# Altium project parry_pcb.PrjPCB
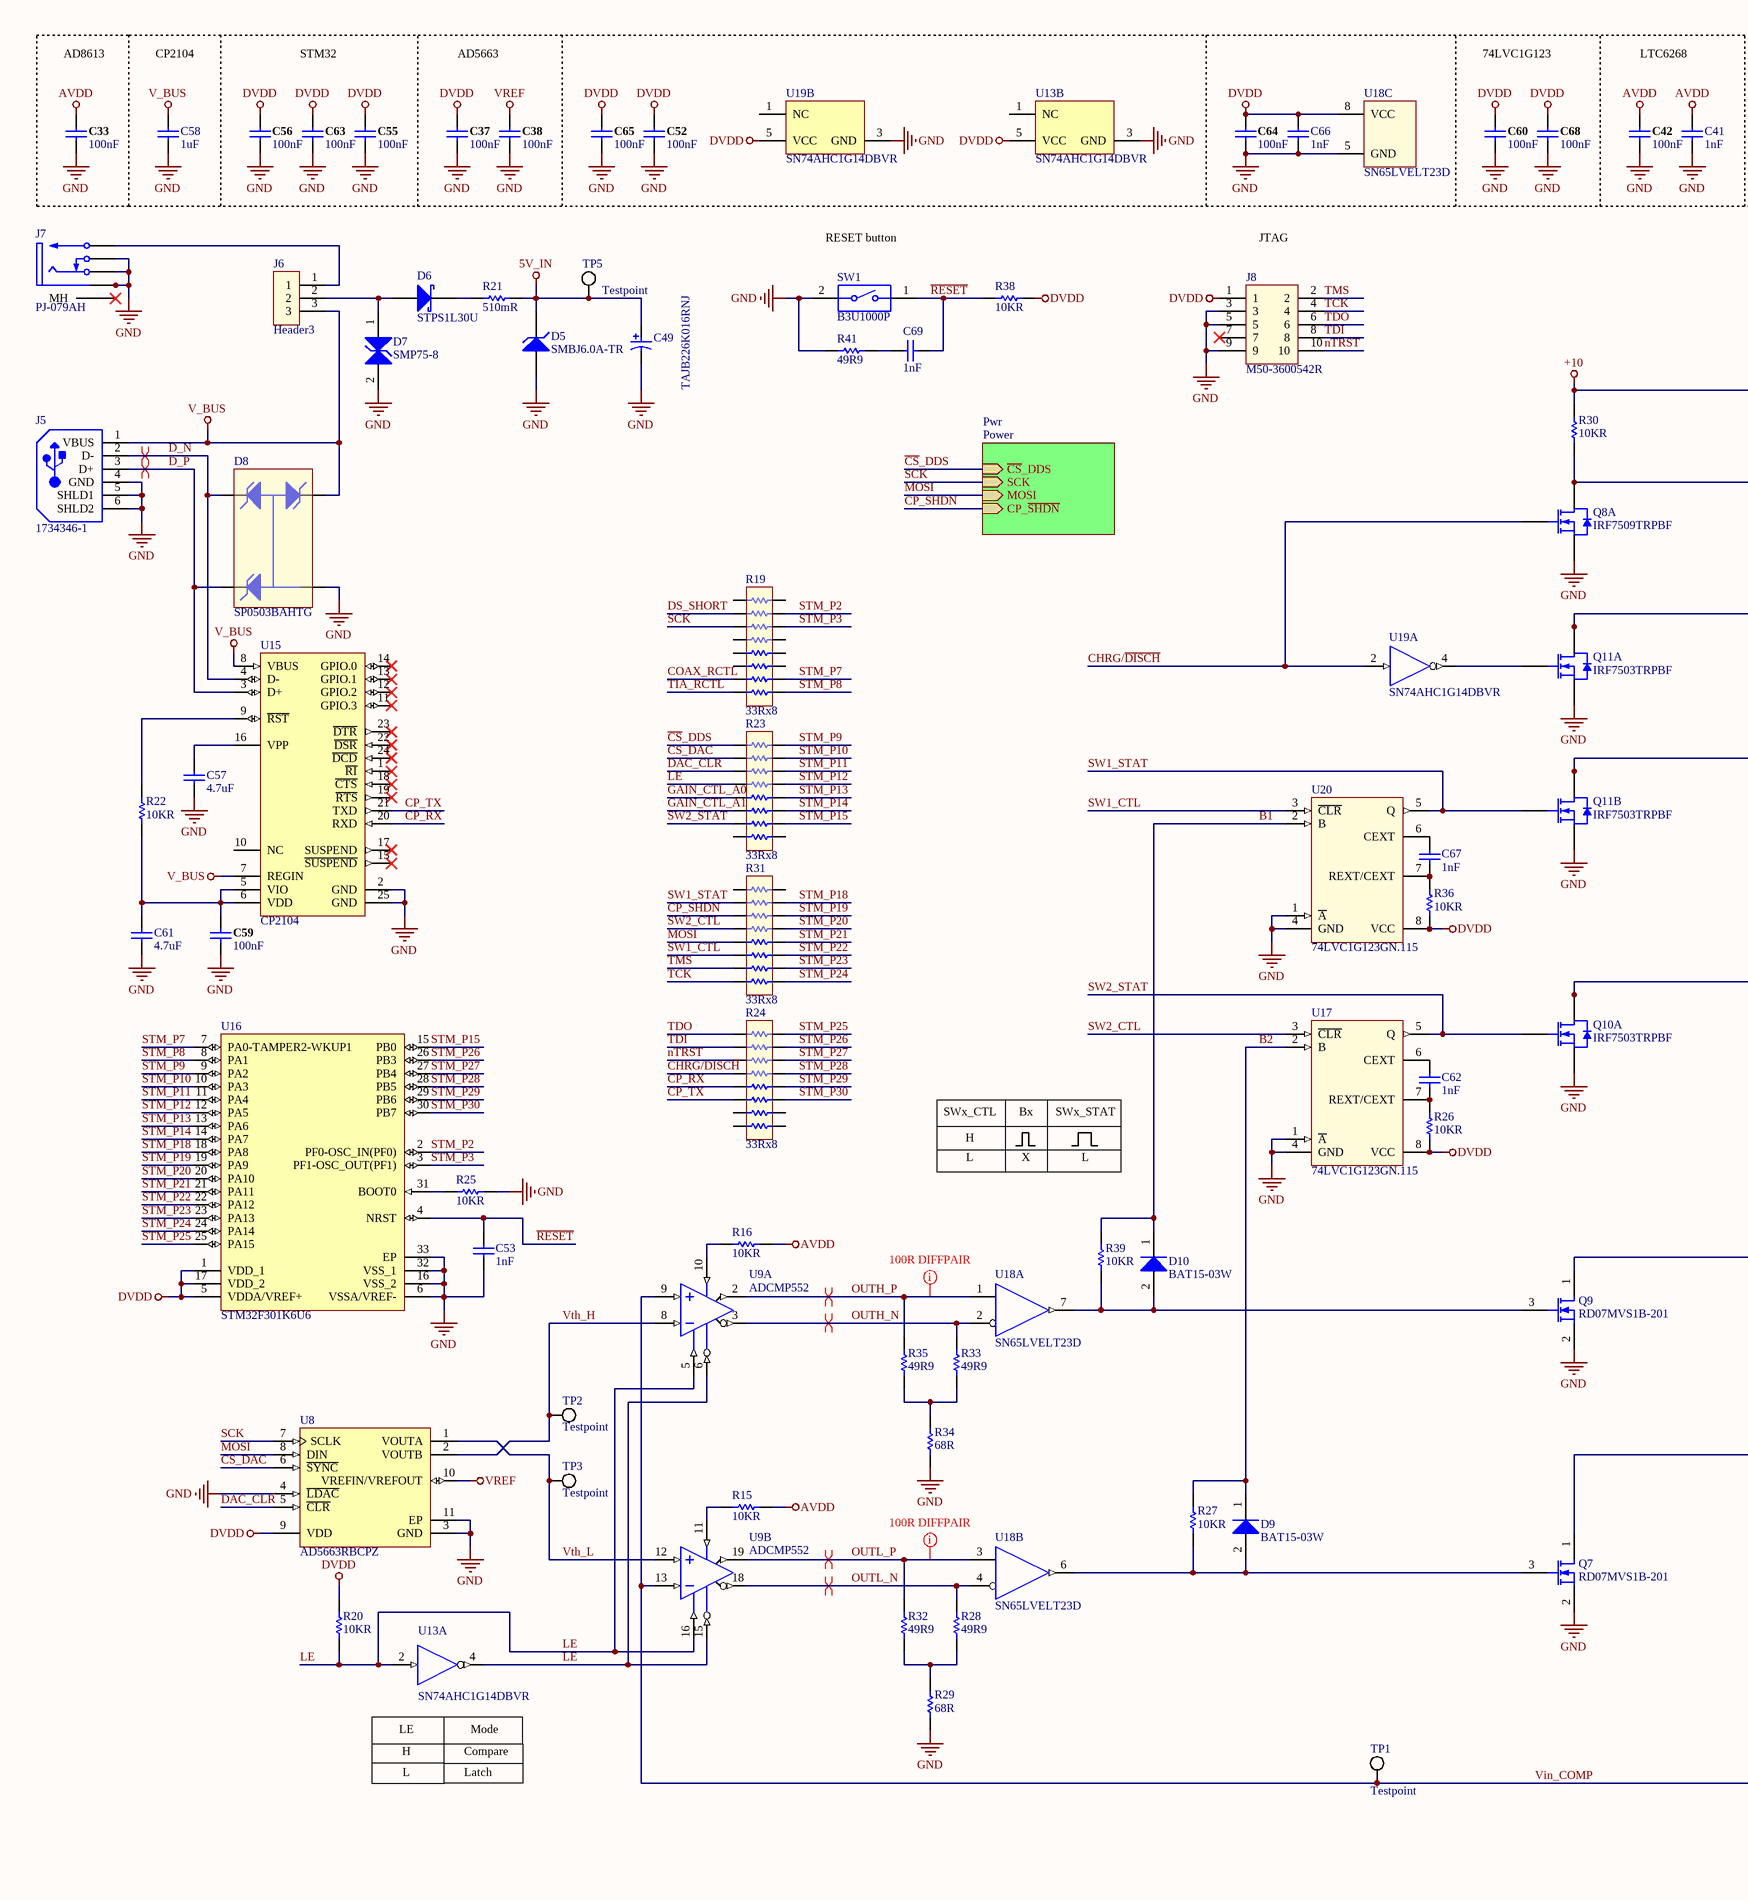
[diagram p0: Main.SchDoc, left]
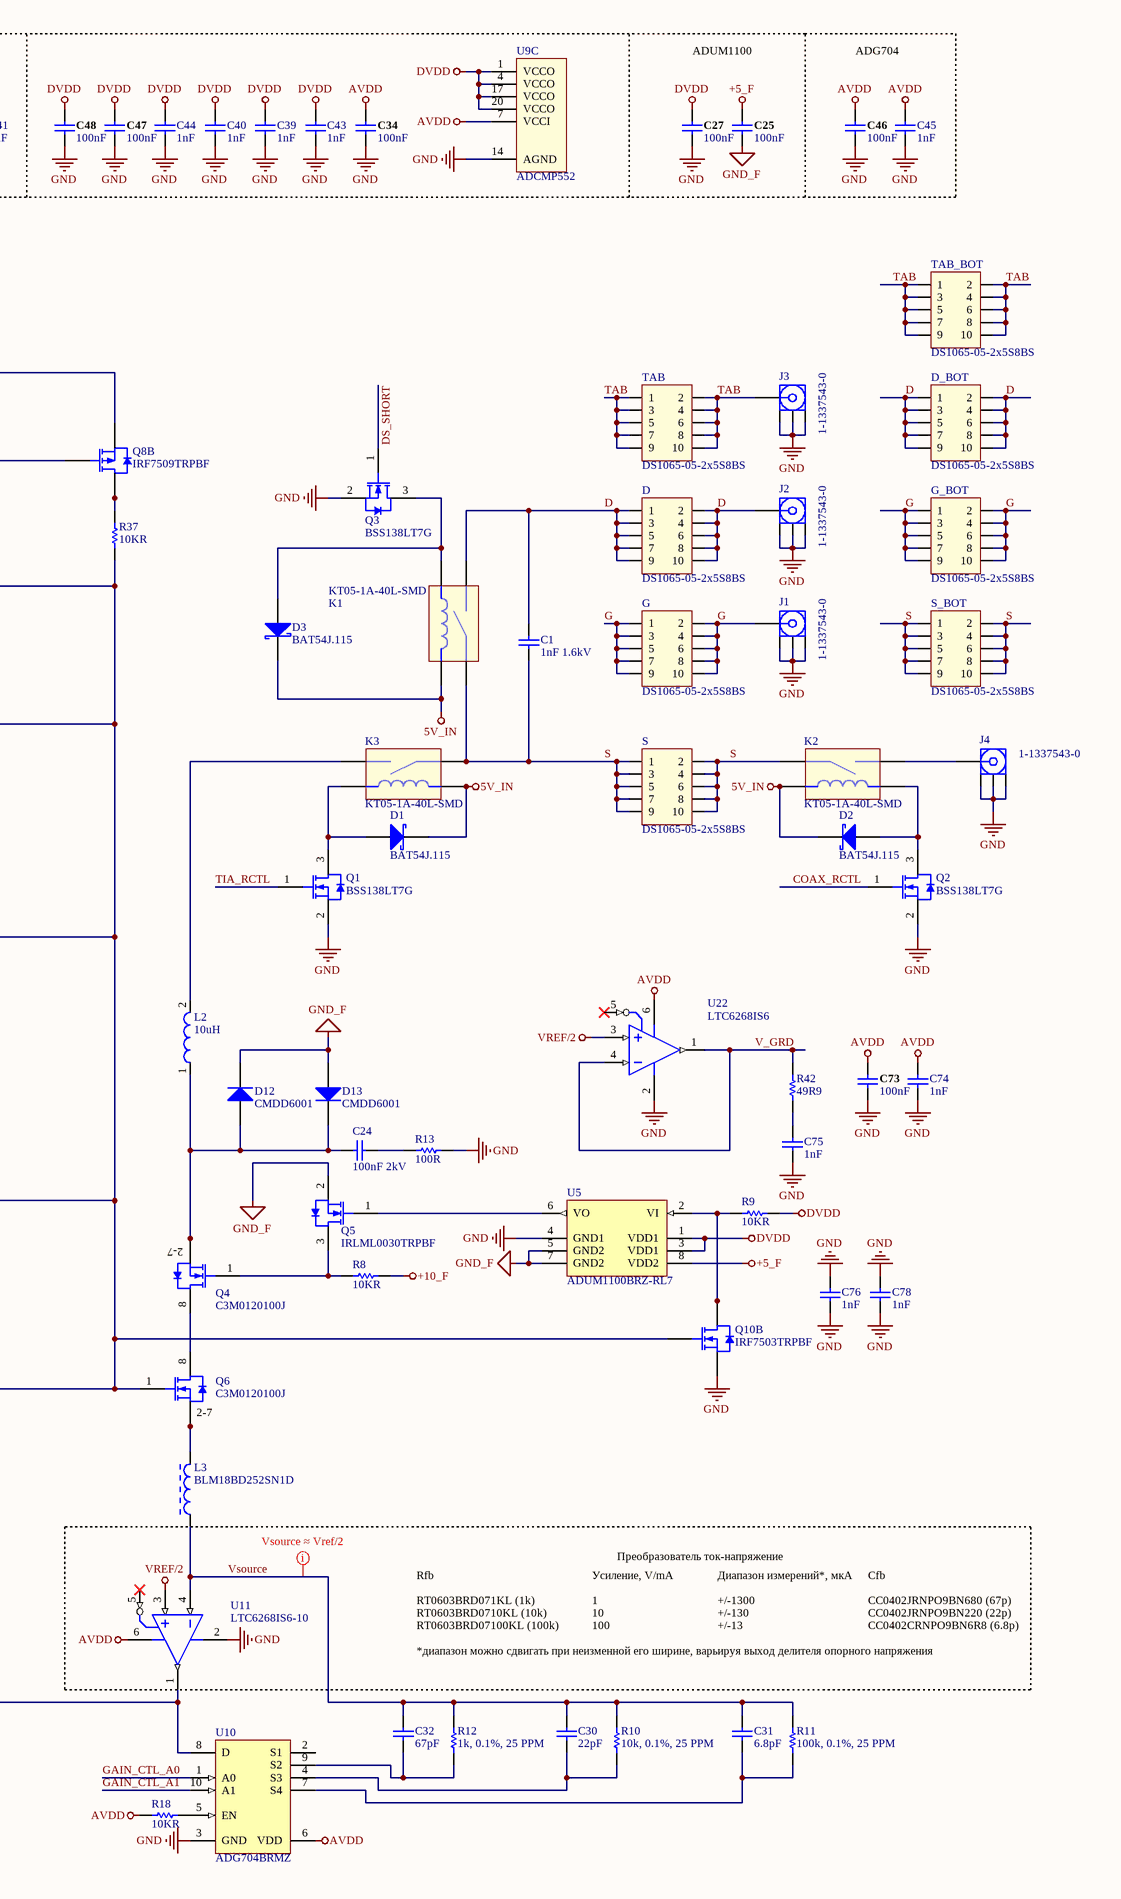
[diagram p1: Main.SchDoc, right]
2 sheets, 199 parts. Net scope: hierarchical (ports join the sheet entries above them; power ports are global).
Board file: parry_pcb.PcbDoc
Sheets:
  Main.SchDoc
    Pwr = Power.SchDoc

## Sheet Main.SchDoc: SEB/SEGR Parry Device Motherboard
size A2; ApprovedBy: N/A; CheckedBy: N/A; Author: BPS; CompanyName: N/A; DrawnBy: BPS; Engineer: BPS; Organization: N/A; Address1: N/A; Address2: N/A; Address3: N/A; Address4: N/A; DocumentNumber: SSP-02A; Revision: A; SheetNumber: 1; SheetTotal: 2; Application_BuildNumber: 1

### Parts
C1  1nF 1.6kV  [KP1836210135]
C24  100nF 2kV  [MKP1845D21L44]
C25  100nF  [CAPC1005]
C27  100nF  [CAPC1005]
C30  22pF  [CAPC1005X55X25ML05T05]
C31  6.8pF  [CAPC1005X55X25ML05T05]
C32  67pF  [CAPC1005X55X25ML05T05]
C33  100nF  [CAPC1005]
C34  100nF  [CAPC1005]
C37  100nF  [CAPC1005]
C38  100nF  [CAPC1005]
C39  1nF  [CAPC1005X55X25ML5T10]
C40  1nF  [CAPC1005X55X25ML5T10]
C41  1nF  [CAPC1005X55X25ML5T10]
C42  100nF  [CAPC1005]
C43  1nF  [CAPC1005X55X25ML5T10]
C44  1nF  [CAPC1005X55X25ML5T10]
C45  1nF  [CAPC1005X55X25ML5T10]
C46  100nF  [CAPC1005]
C47  100nF  [CAPC1005]
C48  100nF  [CAPC1005]
C49  TAJB226K016RNJ  [AVX-TAJ-B-2_M]
C52  100nF  [CAPC1005]
C53  1nF  [CAPC1005X55X25ML5T10]
C55  100nF  [CAPC1005]
C56  100nF  [CAPC1005]
C57  4.7uF  [CAPC1608X90X40LL15T20]
C58  1uF  [CAPC1608X90X40LL15T20]
C59  100nF  [CAPC1005]
C60  100nF  [CAPC1005]
C61  4.7uF  [CAPC1608X90X40LL15T20]
C62  1nF  [CAPC1005X55X25ML5T10]
C63  100nF  [CAPC1005]
C64  100nF  [CAPC1005]
C65  100nF  [CAPC1005]
C66  1nF  [CAPC1005X55X25ML5T10]
C67  1nF  [CAPC1005X55X25ML5T10]
C68  100nF  [CAPC1005]
C69  1nF  [CAPC1005X55X25ML5T10]
C73  100nF  [CAPC1005]
C74  1nF  [CAPC1005X55X25ML5T10]
C75  1nF  [CAPC1005X55X25ML5T10]
C76  1nF  [CAPC1005X55X25ML5T10]
C78  1nF  [CAPC1005X55X25ML5T10]
D  DS1065-05-2x5S8BS  [DS1065-05-2x5S8BS]
D1  BAT54J.115  [SOD-323]
D2  BAT54J.115  [SOD-323]
D3  BAT54J.115  [SOD-323]
D5  SMBJ6.0A-TR  [DO-214AA]
D6  STPS1L30U  [DO-214AA]
D7  SMP75-8  [DO-214AA]
D8  SP0503BAHTG  [SOT143-4]
D9  BAT15-03W  [SOD-323]
D10  BAT15-03W  [SOD-323]
D12  CMDD6001  [SOD-323]
D13  CMDD6001  [SOD-323]
D_BOT  DS1065-05-2x5S8BS  [DS1065-05-2x5S8BS]
G  DS1065-05-2x5S8BS  [DS1065-05-2x5S8BS]
G_BOT  DS1065-05-2x5S8BS  [DS1065-05-2x5S8BS]
J1  1-1337543-0  [1-1337543-0]
J2  1-1337543-0  [1-1337543-0]
J3  1-1337543-0  [1-1337543-0]
J4  1-1337543-0  [1-1337543-0]
J5  1734346-1  [TECO-1734346-1_V]
J6  Header3  [Header3]
J7  PJ-079AH  [PJ-079AH]
J8  M50-3600542R  [M50-3600542R]
K1  KT05-1A-40L-SMD  [KT05-1A-40L-SMD]
K2  KT05-1A-40L-SMD  [KT05-1A-40L-SMD]
K3  KT05-1A-40L-SMD  [KT05-1A-40L-SMD]
L2  10uH  [L1210H1.2]
L3  BLM18BD252SN1D  [MURA-BLM18-F-H1-CHIP-2_V]
Q1  BSS138LT7G  [SOT-23-3]
Q2  BSS138LT7G  [SOT-23-3]
Q3  BSS138LT7G  [SOT-23-3]
Q4  C3M0120100J  [D2PAK-7L]
Q5  IRLML0030TRPBF  [INTR-SOT-23-3_V]
Q6  C3M0120100J  [D2PAK-7L]
Q7  RD07MVS1B-201  [RD07MVS1B]
Q8  IRF7509TRPBF  [Micro8]  (parts A,B of 2)
Q9  RD07MVS1B-201  [RD07MVS1B]
Q10  IRF7503TRPBF  [Micro8]  (parts A,B of 2)
Q11  IRF7503TRPBF  [Micro8]  (parts A,B of 2)
R8  10KR  [RESC1005X40X25LL05T10]
R9  10KR  [RESC1005X40X25LL05T10]
R10  10k, 0.1%, 25 PPM  [RT0603]
R11  100k, 0.1%, 25 PPM  [RT0603]
R12  1k, 0.1%, 25 PPM  [RT0603]
R13  100R  [OF101JE]
R15  10KR  [RESC1005X40X25LL05T10]
R16  10KR  [RESC1005X40X25LL05T10]
R18  10KR  [RESC1005X40X25LL05T10]
R19  33Rx8  [R0402H60x4]
R20  10KR  [RESC1005X40X25LL05T10]
R21  510mR  [RESC3116X65X40NL10T20]
R22  10KR  [RESC1005X40X25LL05T10]
R23  33Rx8  [R0402H60x4]
R24  33Rx8  [R0402H60x4]
R25  10KR  [RESC1005X40X25LL05T10]
R26  10KR  [RESC1005X40X25LL05T10]
R27  10KR  [RESC1005X40X25LL05T10]
R28  49R9  [RESC1005X40X25LL05T10]
R29  68R  [RESC1005X40X25ML05T10]
R30  10KR  [RESC1005X40X25LL05T10]
R31  33Rx8  [R0402H60x4]
R32  49R9  [RESC1005X40X25LL05T10]
R33  49R9  [RESC1005X40X25LL05T10]
R34  68R  [RESC1005X40X25ML05T10]
R35  49R9  [RESC1005X40X25LL05T10]
R36  10KR  [RESC1005X40X25LL05T10]
R37  10KR  [RESC1005X40X25LL05T10]
R38  10KR  [RESC1005X40X25LL05T10]
R39  10KR  [RESC1005X40X25LL05T10]
R41  49R9  [RESC1005X40X25LL05T10]
R42  49R9  [RESC1005X40X25LL05T10]
S  DS1065-05-2x5S8BS  [DS1065-05-2x5S8BS]
S_BOT  DS1065-05-2x5S8BS  [DS1065-05-2x5S8BS]
SW1  B3U1000P  [B3U]
TAB  DS1065-05-2x5S8BS  [DS1065-05-2x5S8BS]
TAB_BOT  DS1065-05-2x5S8BS  [DS1065-05-2x5S8BS]
TP1  Testpoint  [TESTPOINT]
TP2  Testpoint  [TESTPOINT]
TP3  Testpoint  [TESTPOINT]
TP5  Testpoint  [TESTPOINT]
U5  ADUM1100BRZ-RL7  [ADI-R-8_M]
U8  AD5663RBCPZ  [LFCSP-10]
U9  ADCMP552  [QSOP-20]  (parts A,B,C of 3)
U10  ADG704BRMZ  [ADI-RM-10_M]
U11  LTC6268IS6-10  [SOT-23-6]
U13  SN74AHC1G14DBVR  [DBV0005A_L]  (parts A,B of 2)
U15  CP2104  [QFN-24]
U16  STM32F301K6U6  [STM-UFQFPN32_L]
U17  74LVC1G123GN.115  [SOT1116]
U18  SN65LVELT23D  [SOIC-8]  (parts A,B,C of 3)
U19  SN74AHC1G14DBVR  [DBV0005A_L]  (parts A,B of 2)
U20  74LVC1G123GN.115  [SOT1116]
U22  LTC6268IS6  [SOT-23-6]

### Sub-sheets
Pwr = Power: CP_~{SHDN} (in), ~{CS}_DDS (in), SCK (in), MOSI (in)

### Nets
5V_IN: C49.1 D1.1(K) D2.1(K) D3.1(K) D5.1(K) K1.4 K2.4 K3.4 R21.2 TP5.1
+5_F: C25.1 U5.8(VDD2)
+10: Q8.3 R30.1
+10_F: R8.2
AVDD: C33.1 C34.1 C41.2 C42.1 C45.2 C46.1 C73.1 C74.2 R15.1 R16.1 R18.1 U9.7(VCCI) U10.6(VDD) U11.6(V+) U22.6(V+)
DVDD: C27.1 C37.1 C39.2 C40.2 C43.2 C44.2 C47.1 C48.1 C52.1 C55.1 C56.1 C60.1 C63.1 C64.1 C65.1 C66.2 C68.1 J8.1 R9.2 R20.1 R26.2 R36.2 R38.2 U5.1(VDD1) U5.3(VDD1) U8.9(VDD) U9.1(VCCO) U9.4(VCCO) U9.17(VCCO) U9.20(VCCO) U13.5(VCC) U16.1(VDD_1) U16.5(VDDA/VREF+) U16.17(VDD_2) U17.8(VCC) U18.8(VCC) U19.5(VCC) U20.8(VCC)
GND: C27.2 C33.2 C34.2 C37.2 C38.2 C39.1 C40.1 C41.1 C42.2 C43.1 C44.1 C45.1 C46.2 C47.2 C48.2 C49.2 C52.2 C53.2 C55.2 C56.2 C57.1 C58.2 C59.2 C60.2 C61.1 C63.2 C64.2 C65.2 C66.1 C68.2 C73.2 C74.1 C75.2 C76.1 C76.2 C78.1 C78.2 D5.2(A) D7.2(C) D8.1 J1.2 J1.3 J1.4 J2.2 J2.3 J2.4 J3.2 J3.3 J3.4 J4.2 J4.3 J4.4 J5.4(GND) J5.5(SHLD1) J5.6(SHLD2) J7.2 J7.3 J7.SH1 J7.SH2 J8.3 J8.5 J8.9 Q1.2(G) Q2.2(G) Q3.2(G) Q7.2(S) Q8.1 Q9.2(S) Q10.1 Q10.3 Q11.1 Q11.3 R13.2 R25.2 R29.1 R34.1 R41.2 SW1.2 U5.4(GND1) U8.3(GND) U8.4(~{LDAC}) U8.11(EP) U9.14(AGND) U10.3(GND) U11.2(V-) U13.3(GND) U15.2(GND) U15.25(GND) U16.6(VSSA/VREF-) U16.16(VSS_2) U16.32(VSS_1) U16.33(EP) U17.1(~{A}) U17.4(GND) U18.5(GND) U19.3(GND) U20.1(~{A}) U20.4(GND) U22.2(V-)
GND_F: C25.2 D12.1(K) D13.2(A) Q5.2(S) U5.5(GND2) U5.7(GND2)
V_BUS: C58.1 D8.2 J5.1(VBUS) J6.3 U15.7(REGIN) U15.8(VBUS)
VREF: C38.1 U8.10(VREFIN/VREFOUT)
VREF/2: U11.3(IN+) U22.3(IN+)
B1: D10.1(K) R39.1 U20.2(B)
B2: D9.1(K) R27.1 U17.2(B)
~{CS}_DAC: R23.2 U8.6(~{SYNC})
~{CS}_DDS: R23.1 ; sheet Pwr/~{CS}_DDS
CHRG/~{DISCH}: Q8.2 R24.4 U19.2(A)
COAX_RCTL: Q2.1(G) R19.7
CP_RX: R24.5 U15.20(RXD)
CP_~{SHDN}: R31.3 ; sheet Pwr/CP_~{SHDN}
CP_TX: R24.6 U15.21(TXD)
D: C1.2 D.1 D.2 D.3 D.4 D.5 D.6 D.7 D.8 D.9 D.10 D_BOT.1 D_BOT.2 D_BOT.3 D_BOT.4 D_BOT.5 D_BOT.6 D_BOT.7 D_BOT.8 D_BOT.9 D_BOT.10 J2.1 K1.2
D_N: D8.3 J5.2(D-) U15.4(D-)
D_P: D8.4 J5.3(D+) U15.3(D+)
DAC_~{CLR}: R23.3 U8.5(~{CLR})
DS_SHORT: Q3.1(G) R19.2
G: G.1 G.2 G.3 G.4 G.5 G.6 G.7 G.8 G.9 G.10 G_BOT.1 G_BOT.2 G_BOT.3 G_BOT.4 G_BOT.5 G_BOT.6 G_BOT.7 G_BOT.8 G_BOT.9 G_BOT.10 J1.1
GAIN_CTL_A0: R23.5 U10.1(A0)
GAIN_CTL_A1: R23.6 U10.10(A1)
~{LE}: U9.6(~{LEA}) U9.15(~{LEB}) U13.4(Y)
LE: R20.2 R23.4 U9.5(LEA) U9.16(LEB) U13.2(A)
MOSI: R31.5 U8.8(DIN) ; sheet Pwr/MOSI
nTRST: J8.10 R24.3
OUTH_N: R33.2 U9.3(~{QA}) U18.2(~{D0})
OUTH_P: R35.2 U9.2(QA) U18.1(D0)
OUTL_N: R28.2 U9.18(~{QB}) U18.4(~{D1})
OUTL_P: R32.2 U9.19(QB) U18.3(D1)
~{RESET}: C53.1 C69.1 R38.1 SW1.1 U16.4(NRST)
S: C1.1 K1.1 K2.1 K3.1 S.1 S.2 S.3 S.4 S.5 S.6 S.7 S.8 S.9 S.10 S_BOT.1 S_BOT.2 S_BOT.3 S_BOT.4 S_BOT.5 S_BOT.6 S_BOT.7 S_BOT.8 S_BOT.9 S_BOT.10
SCK: R19.3 U8.7(SCLK) ; sheet Pwr/SCK
STM_P2: R19.15 U16.2(PF0-OSC_IN(PF0))
STM_P3: R19.14 U16.3(PF1-OSC_OUT(PF1))
STM_P7: R19.10 U16.7(PA0-TAMPER2-WKUP1)
STM_P8: R19.9 U16.8(PA1)
STM_P9: R23.16 U16.9(PA2)
STM_P10: R23.15 U16.10(PA3)
STM_P11: R23.14 U16.11(PA4)
STM_P12: R23.13 U16.12(PA5)
STM_P13: R23.12 U16.13(PA6)
STM_P14: R23.11 U16.14(PA7)
STM_P15: R23.10 U16.15(PB0)
STM_P18: R31.15 U16.18(PA8)
STM_P19: R31.14 U16.19(PA9)
STM_P20: R31.13 U16.20(PA10)
STM_P21: R31.12 U16.21(PA11)
STM_P22: R31.11 U16.22(PA12)
STM_P23: R31.10 U16.23(PA13)
STM_P24: R31.9 U16.24(PA14)
STM_P25: R24.16 U16.25(PA15)
STM_P26: R24.15 U16.26(PB3)
STM_P27: R24.14 U16.27(PB4)
STM_P28: R24.13 U16.28(PB5)
STM_P29: R24.12 U16.29(PB6)
STM_P30: R24.11 U16.30(PB7)
SW1_CTL: R31.6 U20.3(~{CLR})
SW1_STAT: Q11.4 R31.2 U20.5(Q)
SW2_CTL: R31.4 U17.3(~{CLR})
SW2_STAT: Q10.2 R23.7 U17.5(Q)
TAB: J3.1 TAB.1 TAB.2 TAB.3 TAB.4 TAB.5 TAB.6 TAB.7 TAB.8 TAB.9 TAB.10 TAB_BOT.1 TAB_BOT.2 TAB_BOT.3 TAB_BOT.4 TAB_BOT.5 TAB_BOT.6 TAB_BOT.7 TAB_BOT.8 TAB_BOT.9 TAB_BOT.10
TCK: J8.4 R31.8
TDI: J8.8 R24.2
TDO: J8.6 R24.1
TIA_RCTL: Q1.1(G) R19.8
TMS: J8.2 R31.7
V_GRD: R42.1 U22.1(OUT) U22.4(IN-)
Vin_COMP: TP1.1 U9.9(+INA) U9.13(-INB) U10.8(D) U11.1(OUT)
Vsource: C30.2 C31.1 C32.1 L3.1 R10.2 R11.2 R12.2 U11.4(IN-)
Vth_H: TP2.1 U8.2(VOUTB) U9.8(-INA)
Vth_L: TP3.1 U8.1(VOUTA) U9.12(+INB)
NetC24_1: C24.1 D12.2(A) D13.1(K) L2.1 Q4.2(S) Q4.3(S) Q4.4(S) Q4.5(S) Q4.6(S) Q4.7(S)
NetC24_2: C24.2 R13.1
NetC30_1: C30.1 R10.1 U10.4(S3)
NetC31_2: C31.2 R11.1 U10.7(S4)
NetC32_2: C32.2 R12.1 U10.9(S2)
NetC57_2: C57.2 U15.16(VPP)
NetC59_1: C59.1 C61.2 R22.2 U15.5(VIO) U15.6(VDD)
NetC62_1: C62.1 R26.1 U17.7(REXT/CEXT)
NetC62_2: C62.2 U17.6(CEXT)
NetC67_1: C67.1 R36.1 U20.7(REXT/CEXT)
NetC67_2: C67.2 U20.6(CEXT)
NetC69_2: C69.2 R41.1
NetC75_1: C75.1 R42.2
NetD1_2: D1.2(A) K3.3 Q1.3(G)
NetD2_2: D2.2(A) K2.3 Q2.3(G)
NetD3_2: D3.2(A) K1.3 Q3.3(G)
NetD6_1: D6.1(K) R21.1
NetD6_2: D6.2(A) D7.1(C) J6.2
NetD9_2: D9.2(A) Q7.3(G) R27.2 U18.6(Q1)
NetD10_2: D10.2(A) Q9.3(G) R39.2 U18.7(Q0)
NetJ4_1: J4.1 K2.2
NetJ6_1: J6.1 J7.1
NetK3_2: K3.2 L2.2
NetL3_2: L3.2 Q6.2(S) Q6.3(S) Q6.4(S) Q6.5(S) Q6.6(S) Q6.7(S)
NetQ4_1: Q4.1(G) Q5.3(D) R8.1
NetQ4_8: Q4.8(D) Q6.8(D)
NetQ5_1: Q5.1(G) U5.6(VO)
NetQ6_1: Q6.1(G) Q7.1(D) Q9.1(D) Q10.4 Q10.7 Q10.8 Q11.5 Q11.6 Q11.7 Q11.8 R37.2
NetQ8_4: Q8.4 Q8.7 Q8.8 R30.2
NetQ8_5: Q8.5 Q8.6 R37.1
NetQ10_5: Q10.5 Q10.6 R9.1 U5.2(VI)
NetQ11_2: Q11.2 U19.4(Y)
NetR15_2: R15.2 U9.11(HYSB)
NetR16_2: R16.2 U9.10(HYSA)
NetR18_2: R18.2 U10.5(EN)
NetR22_1: R22.1 U15.9(~{RST})
NetR25_1: R25.1 U16.31(BOOT0)
NetR28_1: R28.1 R29.2 R32.1
NetR33_1: R33.1 R34.2 R35.1

Not connected (* = marked no-connect by the designer): J7 6(MH)*; J8 7*; R19 1 4 5 6 11 12 13 16; R23 8 9; R24 7 8 9 10; R31 1 16; U10 2(S1); U11 5(~{SHDN})*; U13 1(NC); U15 1(~{RI})* 10(NC) 11(GPIO.3)* 12(GPIO.2)* 13(GPIO.1)* 14(GPIO.0)* 15(~{SUSPEND})* 17(SUSPEND)* 18(~{CTS})* 19(~{RTS})* 22(~{DSR})* 23(~{DTR})* 24(~{DCD})*; U19 1(NC); U22 5(~{SHDN})*

### Layout directives
differential pair: D_N, D_P, OUTH_N, OUTH_P, OUTL_N, OUTL_P
mark named 100R DIFFPAIR: OUTH_P, OUTL_P
mark named Vsource ≈ Vref/2: Vsource

### Notes on the sheet
- AD8613
- CP2104
- STM32
- AD5663
- 74LVC1G123
- LTC6268
- ADUM1100
- ADG704
- RESET button
- JTAG
- SWx_CTL
- H
- Bx
- SWx_STAT
- L
- X
- Rfb
- Усиление, V/mA
- Преобразователь ток-напряжение
- Диапазон измерений*, мкА
- Cfb
- RT0603BRD071KL (1k)
- RT0603BRD0710KL (10k)
- RT0603BRD07100KL (100k)
- 1
- 10
- 100
- +/-1300
- +/-130
- +/-13
- CC0402JRNPO9BN680 (67p)
- CC0402JRNPO9BN220 (22p)
- CC0402CRNPO9BN6R8 (6.8p)
- LE
- Compare
- Latch
- Mode
- *диапазон можно сдвигать при неизменной его ширине, варьируя выход делителя опорного напряжения
- Title
- Size:
- Date:
- File:
- A2
- Number:
- Time:
- Revision:
- Sheet
- of
- (in symbol C3M0120100J) 2-7

### Library data of the parts
C1 = KP1836210135: AC and Pulse Film/Foil Capacitors / Radial Potted Type
C24 = MKP1845410204: Film Capacitors .1uF 2000volt 5%
C25 C27 C33 C34 C37 C38 C42 C46-C48 C52 C55 C56 C59 C60 C63-C65 C68 C73 = CMP-0001-00074-1: CC0402KRX7R7BB104; Rated Voltage: 16 V; Tolerance: 10 %; Polarity: Non-Polarized; Dielectric: X7R; Capacitance: 0.1 uF; ClassName: Board Template Device; Status: Production; Mounting Technology: Surface Mount; Technology: Ceramic; Category: Capacitor; Publisher: Altium
C30 = CMP-2100-03589-1: CC0402JRNPO9BN220; Manufacturer: Yageo; Insulation Resistance: 100GR; Voltage Rating (DC): 50V; Dielectric Material: Ceramic; Tolerance: 5%; Temperature Coefficient: 30ppm/degC; Dielectric: C0G; Capacitance: 10pF; Termination: SMD/SMT; Package Reference: 0402; Lead Free: LeadFree; Composition: Ceramic; Case Code (Metric): 1005; Voltage Rating: 50V; Packaging: TapeandReel; Manufacturer URL: http://www.yageo.com/; REACH SVHC: NoSVHC; Max Operating Temperature: 125degC; Length: 1mm; Mount: SurfaceMount; Depth: 0.5mm; Min Operating Temperature: -55degC; Number of Pins: 2; Width: 0.02inch; Datasheet Version: Rev. 14, 07/2016; Package Quantity: 1; Datasheet URL: http://www.yageo.com/documents/recent/UPY-GP_NP0_16V-to-50V_14.pdf; Case Code (Imperial): 0402; RoHSCompliant: True; Radiation Hardening: No; Height: 0.5mm; Case/Package: 0402; Thickness: 0.022inch; Package Description: 2-Pin Surface Mount Device, Body 1 x 0.5 mm; Voltage: 50V
C31 = CMP-2100-03589-1: CC0402CRNPO9BN6R8; Manufacturer: Yageo; Insulation Resistance: 100GR; Voltage Rating (DC): 50V; Dielectric Material: Ceramic; Tolerance: 5%; Temperature Coefficient: 30ppm/degC; Dielectric: C0G; Capacitance: 10pF; Termination: SMD/SMT; Package Reference: 0402; Lead Free: LeadFree; Composition: Ceramic; Case Code (Metric): 1005; Voltage Rating: 50V; Packaging: TapeandReel; Manufacturer URL: http://www.yageo.com/; REACH SVHC: NoSVHC; Max Operating Temperature: 125degC; Length: 1mm; Mount: SurfaceMount; Depth: 0.5mm; Min Operating Temperature: -55degC; Number of Pins: 2; Width: 0.02inch; Datasheet Version: Rev. 14, 07/2016; Package Quantity: 1; Datasheet URL: http://www.yageo.com/documents/recent/UPY-GP_NP0_16V-to-50V_14.pdf; Case Code (Imperial): 0402; RoHSCompliant: True; Radiation Hardening: No; Height: 0.5mm; Case/Package: 0402; Thickness: 0.022inch; Package Description: 2-Pin Surface Mount Device, Body 1 x 0.5 mm; Voltage: 50V
C32 = CMP-2100-03589-1: CC0402JRNPO9BN680; Manufacturer: Yageo; Insulation Resistance: 100GR; Voltage Rating (DC): 50V; Dielectric Material: Ceramic; Tolerance: 5%; Temperature Coefficient: 30ppm/degC; Dielectric: C0G; Capacitance: 10pF; Termination: SMD/SMT; Package Reference: 0402; Lead Free: LeadFree; Composition: Ceramic; Case Code (Metric): 1005; Voltage Rating: 50V; Packaging: TapeandReel; Manufacturer URL: http://www.yageo.com/; REACH SVHC: NoSVHC; Max Operating Temperature: 125degC; Length: 1mm; Mount: SurfaceMount; Depth: 0.5mm; Min Operating Temperature: -55degC; Number of Pins: 2; Width: 0.02inch; Datasheet Version: Rev. 14, 07/2016; Package Quantity: 1; Datasheet URL: http://www.yageo.com/documents/recent/UPY-GP_NP0_16V-to-50V_14.pdf; Case Code (Imperial): 0402; RoHSCompliant: True; Radiation Hardening: No; Height: 0.5mm; Case/Package: 0402; Thickness: 0.022inch; Package Description: 2-Pin Surface Mount Device, Body 1 x 0.5 mm; Voltage: 50V
C39-C41 C43-C45 C53 C62 C66 C67 C69 C74-C76 C78 = CMP-2100-03592-1: CC0402JRX7R9BB102; Manufacturer: Yageo; Voltage Rating (DC): 50V; Tolerance: 10%; Dielectric: X7R; Capacitance: 10nF; Package Description: 2-Pin Surface Mount Device, Body 1 x 0.5 mm; REACH SVHC: NoSVHC; Depth: 0.5mm; Length: 1mm; Radiation Hardening: No; Thickness: 0.022inch; Lead Free: LeadFree; Height: 0.5mm; Packaging: TapeandReel; RoHSCompliant: True; Termination: SMD/SMT; Min Operating Temperature: -55degC; Composition: Ceramic; Case Code (Metric): 1005; Voltage Rating: 50V; Case Code (Imperial): 0402; Mount: SurfaceMount; Package Reference: 0402; Voltage: 50V; Manufacturer URL: http://www.yageo.com/; Width: 0.5mm; Package Quantity: 1; Datasheet Version: Rev. 15, 10/2016; Max Operating Temperature: 125degC; Datasheet URL: http://www.yageo.com/documents/recent/UPY-GPHC_X7R_6.3V-to-50V_15.pdf; Case/Package: 0402
C49 = CMP-2100-03689-1: Standard Tantalum, 22 uF, +/- 10%, 16 V, -55 to 125 degC, 2-Pin SMD (1210), RoHS, Tape and Reel; Manufacturer: AVX; Leakage Current: 3.5uA; Dissipation Factor: 6%; Voltage Rating (DC): 16V; Capacitance: 22uF; ESR (Equivalent Series Resistance): 2.3Ohm; Polarity: Polar; Package Quantity: 1; Tolerance: 10%; Number of Pins: 2; Manufacturer URL: http://www.avx.com/; Height - Seated (Max): 0.083inch; Case Code (Imperial): 1210; Package Reference: TAJ-B-2; Height: 1.9mm; Depth: 2.8mm; Packaging: TapeandReel; Termination: SMD/SMT; Case/Package: 1210; Lead Free: LeadFree; Min Operating Temperature: -55degC; RoHSCompliant: True; Dielectric Material: Tantalum; Case Code (Metric): 3528; Width: 2.8mm; Datasheet URL: http://datasheets.avx.com/TAJ.pdf; Radiation Hardening: No; Package Description: 2-Pin Surface Mount Device, Body 3.5 x 2.85 mm; Length: 3.5mm; Voltage Rating: 16V; Datasheet Version: 42401.0; Max Operating Temperature: 125degC; REACH SVHC: NoSVHC; Voltage: 16V
C57 C61 = CMP-2000-06074-1: CC0603KRX5R6BB475; Manufacturer: Yageo; Voltage - Rated: 10V; Temperature Coefficient: X5R; Tolerance: ±10%; Online Catalog: CCSeries; Other Names: 311-1455-6; Capacitance: 4.7µF; EDA / CAD Models: DownloadfromAcceleratedDesigns; Thickness (Max): 0.035"(0.90mm); Mounting Type: SurfaceMount,MLCC; Datasheet Version: Rev. 21, 01/2016; Datasheet URL: http://www.yageo.com/documents/recent/UPY-GPHC_X5R_4V-to-50V-21.pdf; Size / Dimension: 0.063"Lx0.031"W(1.60mmx0.80mm); Standard Package: 1; Operating Temperature: -55°C~85°C; Category: Capacitors; Manufacturer URL: http://www.yageo.com/; Package Reference: 0603; Family: CeramicCapacitors; Series: CC; Packaging: Digi-Reel®; Mounting Technology: SurfaceMount; Package Description: 2-Pin Surface Mount Device, Body 1.6 x 0.8 mm; Applications: GeneralPurpose; Package / Case: 0603(1608Metric)
C58 = CMP-2000-06074-1: CC0603KRX5R7BB105; Manufacturer: Yageo; Voltage - Rated: 10V; Temperature Coefficient: X5R; Tolerance: ±10%; Online Catalog: CCSeries; Other Names: 311-1455-6; Capacitance: 4.7µF; EDA / CAD Models: DownloadfromAcceleratedDesigns; Thickness (Max): 0.035"(0.90mm); Mounting Type: SurfaceMount,MLCC; Datasheet Version: Rev. 21, 01/2016; Datasheet URL: http://www.yageo.com/documents/recent/UPY-GPHC_X5R_4V-to-50V-21.pdf; Size / Dimension: 0.063"Lx0.031"W(1.60mmx0.80mm); Standard Package: 1; Operating Temperature: -55°C~85°C; Category: Capacitors; Manufacturer URL: http://www.yageo.com/; Package Reference: 0603; Family: CeramicCapacitors; Series: CC; Packaging: Digi-Reel®; Mounting Technology: SurfaceMount; Package Description: 2-Pin Surface Mount Device, Body 1.6 x 0.8 mm; Applications: GeneralPurpose; Package / Case: 0603(1608Metric)
D D_BOT G G_BOT S S_BOT TAB TAB_BOT = DS1065-05-2x5S8BS: System: Connector
D7 = SMP75-8: Trisil™ for telecom equipment protection
D8 = SP0503BAHTG: 30pF 30kV Unidirectional TVS Array
D9 D10 = INF-BAT15-03W-2: BAT1503WE6327HTSA1
D12 D13 = CMDD6001: TVS
J5 = CMP-2000-07498-1: USB-B Receptacle Connector, Height 10.87 mm, 0 to 50 degC, RoHS, Tray; Manufacturer: TE Connectivity; Insulation Resistance: 1GR; Number of Contacts: 4; Number of Ports: 1; Plating: Nickel; Case\/Package: SMD/SMT; Insulation Material: Thermoplastic; Gender: Receptacle; Depth: 16mm; Contact Material: Bronze; Length: 16.5mm; ELV: Compliant; Packaging: Tray; RoHSCompliant: true; Number of Terminals: 4; Manufacturer URL: http://www.te.com/; Datasheet Version: Rev. C, 06/2011; Package Reference: 1734346-1; Flammability Rating: UL94V-0; Package Description: 4-Pin Pin Surface Mount Device, Body 12.04 x 16 mm, Height 10.87 mm; Mount: Horizontal; Mounting Technology: SurfaceMount; REACH SVHC: Unknown; Material: Bronze; Housing Colour: Black; Contact Plating: Gold; Package Quantity: 100; Orientation: RightAngle; Termination: SMD/SMT; Housing Material: Nylon; Number of Positions: 4; Datasheet URL: http://www.te.com/commerce/DocumentDelivery/DDEController?Action=srchrtrv&DocNm=1734346&DocType=Customer+Drawing&DocLang=English; Connector Type: Receptacle
J7 = PJ-079AH: DC POWER JACK
J8 = M50-3600542R: System: Connector
L2 = 1277AS-H-100M=P2
L3 = CMP-0686-00418-1: Chip Ferrite Bead for High-speed Signal Lines, 2500 Ohm, 50 mA, -55 to 125 degC, 1.6 x 0.8 x 0.95 mm SMD, Tape and Reel; Manufacturer: Murata; Rated Current: 50 mA; DC Resistance: 1.50 Ohm Max.; Impedance (at 100 MHz): 2500 Ohm +/- 25%; ComponentLink2Description: Datasheet; ComponentLink3Description: Package Specification; ComponentLink3URL: http://www.murata.com/products/catalog/pdf/c31e.pdf; Operating Temperature Range: -55 to 125 degC; ComponentLink1URL: http://www.murata.com/; Mounting Technology: Surface Mount; PartNumber: BLM18BD252SN1D; PackageReference: BLM18_H950-2; ComponentLink2URL: http://www.murata.com/products/catalog/pdf/c31e.pdf; DatasheetVersion: 08/2013; PackageDescription: 2-Pin Chip, Body 1.6 x 0.8 mm, Pitch 1.65 mm; ComponentLink1Description: Manufacturer URL; Packing: Tape and Reel
Q1-Q3 = BSS138LT7G: Power MOSFET / 200 mA, 50 V
Q4 Q6 = C3M0120100J: Silicon Carbide Power MOSFET
Q5 = CMP-2000-06483-1: HEXFET(R) Power MOSFET, 1.3 W, 4.4 ns, -55 to 150 degC, 3-Pin SOT-23, RoHS, Tape and Reel; Manufacturer: International Rectifier; Maximum Drain Source Resistance: 0.027Ω; Transistor Configuration: Single; Channel Mode: Enhancement; Maximum Power Dissipation: 1.3W; Typical Input Capacitance @ Vds: 382pF@15V; Maximum Gate Source Voltage: ±20V; Number of Elements per Chip: 1; Transistor Material: Si; Maximum Gate Threshold Voltage: 2.3V; Typical Turn-On Delay Time: 5.2ns; Maximum Drain Source Voltage: 30V; Typical Turn-Off Delay Time: 7.4ns; Minimum Gate Threshold Voltage: 1.3V; Channel Type: N; Typical Gate Charge @ Vgs: 2.6nC@4.5V; Maximum Continuous Drain Current: 5.3A; Pin Count: 3; Mounting Technology: SurfaceMount; Datasheet URL: https://datasheet.ciiva.com/4442/irlml0030pbf-90019-4442451.pdf; Datasheet Version: 02/2012; Maximum Operating Temperature: +150°C; Category: PowerMOSFET; Package Description: 3-Pin Small Outline Transistor, Body 2.92 x 1.3 mm, Pitch 0.95 mm; Manufacturer URL: http://internationalrectifier.com/; Height: 1.02mm; Minimum Operating Temperature: -55°C; Dimensions: 3.04x1.4x1.02mm; Package Reference: SOT-23-3; Package Type: SOT-23; Mounting Type: SurfaceMount; Length: 3.04mm; Width: 1.4mm
Q7 Q9 = RD07MVS1B-201: RoHS Compliant product, Silicon MOSFET Power Transistor,175MHz,520MHz,7W
R8 R9 R15 R16 R18 R20 R22 R25-R27 R30 R36-R39 = CMP-2002-07353-1: RC0402FR-0710KL; Manufacturer: Yageo / Phycomp; Part Number: RC0402FR-0710KL
R10 = RT0603BRD0710KL
R11 = RT0603BRD07100KL
R12 = RT0603BRD071KL
R13 = OF101JE
R19 R23 R24 R31 = EXB-2HV330JV
R21 = CMP-2003-04066-1: RL1206FR-070R51L; Manufacturer: Yageo; Part Number: RL1206FR-070R068L
R28 R32 R33 R35 R41 R42 = CMP-2002-07709-1: RC0402FR-0749R9L; Manufacturer: Yageo / Phycomp; Part Number: RC0402FR-0749R9L
R29 R34 = CMP-2002-07775-1: RC0402FR-0768RL; Manufacturer: Yageo / Phycomp; Part Number: RC0402FR-0768RL
SW1 = B3U1000P: Ultra-small Surface-mounting Tactile / Switches with High Contact Reliability
U5 = CMP-0534-00055-1: Single Channel Digital Isolator, 2.5 KV rms Insulation Rating, 100 Mbps Data Rate, 18 ns Delay, Industrial, 8-pin SOIC (R-8), Reel; Manufacturer: Analog Devices; Insulation Rating (kVrms): 2.5; ComponentLink3Description: Package Specification; Max Operating Temp (degreesC): 125; ComponentLink2Description: Datasheet; ComponentLink1Description: Manufacturer URL; ComponentLink5Description: URL Link2; PackageReference: R-8; ComponentLink4URL: Product URL:http://www.analog.com/en/interface-isolation/digital-isolators/adum1100/products/product.html; PackageDescription: 8-Pin Standard Small Outline Package, Body 4.9 x 3.9 mm, Pitch 1.27 mm; DatasheetVersion: Rev. I; PackageVersion: 060506-A, 06/2006; ComponentLink1URL: http://www.analog.com/en/index.html; ComponentLink5URL: Reference Circuit:http://www.analog.com/en/interface-isolation/digital-isolators/adum1100/products/product.html#product-recommendations; Max Data Rate: 100Mbps; ComponentLink4Description: URL Link1; ComponentLink3URL: http://www.analog.com/static/imported-files/packages/PKG_PDF/SOIC_Narrow%20(R)/R_8.pdf; Code_JEDEC: MS-012-AA; Mounting Technology: Surface Mount; ComponentLink2URL: http://www.analog.com/static/imported-files/data_sheets/ADUM1100.pdf; PartNumber: ADUM1100BRZ-RL7
U8 = AD5663RBCPZ: Dual 12-/14-/16-Bit nanoDAC with / 5 ppm/°C On-Chip Reference
U9 = ADCMP552: Single-Supply, High Speed / PECL/LVPECL Comparator
U10 = CMP-0798-00103-1: CMOS Low Voltage 4 Ohm, 4-Channel Multiplexer, -40 to 85 degC, 10-pin SOP (RM-10), Tube; Manufacturer: Analog Devices; Bandwidth (Hz): 200M; Supply V Guar Performance: Single_(+3.3V), Single_(+3V), Single_(+5V); Ron (ohms): 4; Max Analog Signal Range: 0 to Vdd; PackageDescription: 10-Pin Mini Small Outline Package, Body 3 x 3 mm, Pitch 0.5 mm; PackageVersion: Aug-05; Packing: Tube; PartNumber: ADG704BRMZ; ComponentLink3Description: Package Specification; ComponentLink3URL: http://www.analog.com/static/imported-files/packages/PKG_PDF/MSOP%28RM%29/RM_10.pdf; ComponentLink2Description: Datasheet; ComponentLink1URL: http://www.analog.com/en/index.html; ComponentLink1Description: Manufacturer URL; ComponentLink2URL: http://www.analog.com/static/imported-files/data_sheets/ADG704.pdf; Mounting Technology: Surface Mount; DatasheetVersion: Rev. A; Code_JEDEC: MO-187-BA; PackageReference: RM-10
U11 = LTC6268IS6-10: 4GHz Ultra-Low Bias / Current FET Input Op Amp
U13 U19 = CMP-2000-07131-1: Single Schmitt-Trigger Inverter Gate, 10.6 ns max, 2 to 5.5 V, -40 to 125 degC, 5-Pin SOT23 (DBV), Green (RoHS & no Sb/Br), Tape and Reel; Manufacturer: Texas Instruments; Supply Voltage Min: 2V; Logic IC Function: SingleInverterwithSchmittTrigger; No. of Pins: 5; Logic IC Family: AHC; Output Current: 8mA; Supply Voltage: 5.5V; Logic Function Number: 741G14; SVHC: NoSVHC(19-Dec-2012); No. of Gates: 1; Base Number: 74; Supply Voltage Range: 2Vto5.5V; Logic IC Base Number: 74114; Logic Case Style: SOT-23; Datasheet Version: Rev. Q, 09/2015; Mounting Technology: SurfaceMount; Termination Type: SMD; Operating Temperature Max: 85°C; IC Generic Number: 74AHC1G14; Operating Temperature Min: -40°C; No. of Inputs: 1; Supply Voltage Max: 5.5V; Datasheet URL: http://www.ti.com/lit/ds/symlink/sn74ahc1g14.pdf; Package Description: 5-Pin Small Outline Transistor, Body 2.9 x 1.6 mm, Pitch 0.95 mm; Operating Temperature Range: -40°Cto+85°C; Output Current Max: 8mA; Package URL: http://www.ti.com/lit/ml/mpds018l/mpds018l.pdf; Package Reference: DBV0005A; Logic Type: Inverter; Manufacturer URL: http://www.ti.com/; Package / Case: SOT-23
  U13: PartId: 2
U16 = CMP-0537-00004-1: ARM Cortex-M4 32-bit MCU, 32 KB Flash, 16 KB Internal RAM, 24 I/Os, 32-Pin UFQFPN, -40 to 85 degC, Tray; I/Os (High Current): 24; Supply Voltage(Vcc) min (V): 2; Operating Frequency(F) (Processor speed) (MHz): 72; D/A Converter: 1; FLASH Size (Prog) (kB): 32; Internal RAM Size (kB): 16; Package Reference: UFQFPN32; Package Description: 32-Pin Ultra Thin Fine Pitch Quad Flat No-Lead, 5 x 5 x 0.6 mm Body, 0.5 mm Pitch, Exposed Pad 3.5 x 3.5 mm; Mounting Technology: Surface Mount; ComponentLink1Description: Manufacturer URL; ComponentLink2Description: Datasheet; ComponentLink2URL: http://www.st.com/st-web-ui/static/active/en/resource/technical/document/datasheet/DM00093332.pdf; ComponentLink1URL: http://www.st.com/; Packing: Tray; DatasheetVersion: Rev. 6; Core: ARM Cortex-M4
U17 U20 = 74LVC1G123GN.115: Single retriggerable monostable multivibrator
U18 = SN65LVELT23D: 3.3-V Dual Differential LVPECL/LVDS Buffer to LVTTL Translator
U22 = LTC6268IS6: 500MHz Ultra-Low Bias / Current FET Input Op Amp

## Sheet Power.SchDoc: SEB/SEGR Parry dev. PWR System
size A2; ApprovedBy: N/A; CheckedBy: N/A; Author: BPS; CompanyName: N/A; DrawnBy: BPS; Engineer: BPS; Organization: N/A; Address1: N/A; Address2: N/A; Address3: N/A; Address4: N/A; DocumentNumber: SSP-03; Revision: A; SheetNumber: 2; SheetTotal: 2; Application_BuildNumber: 1
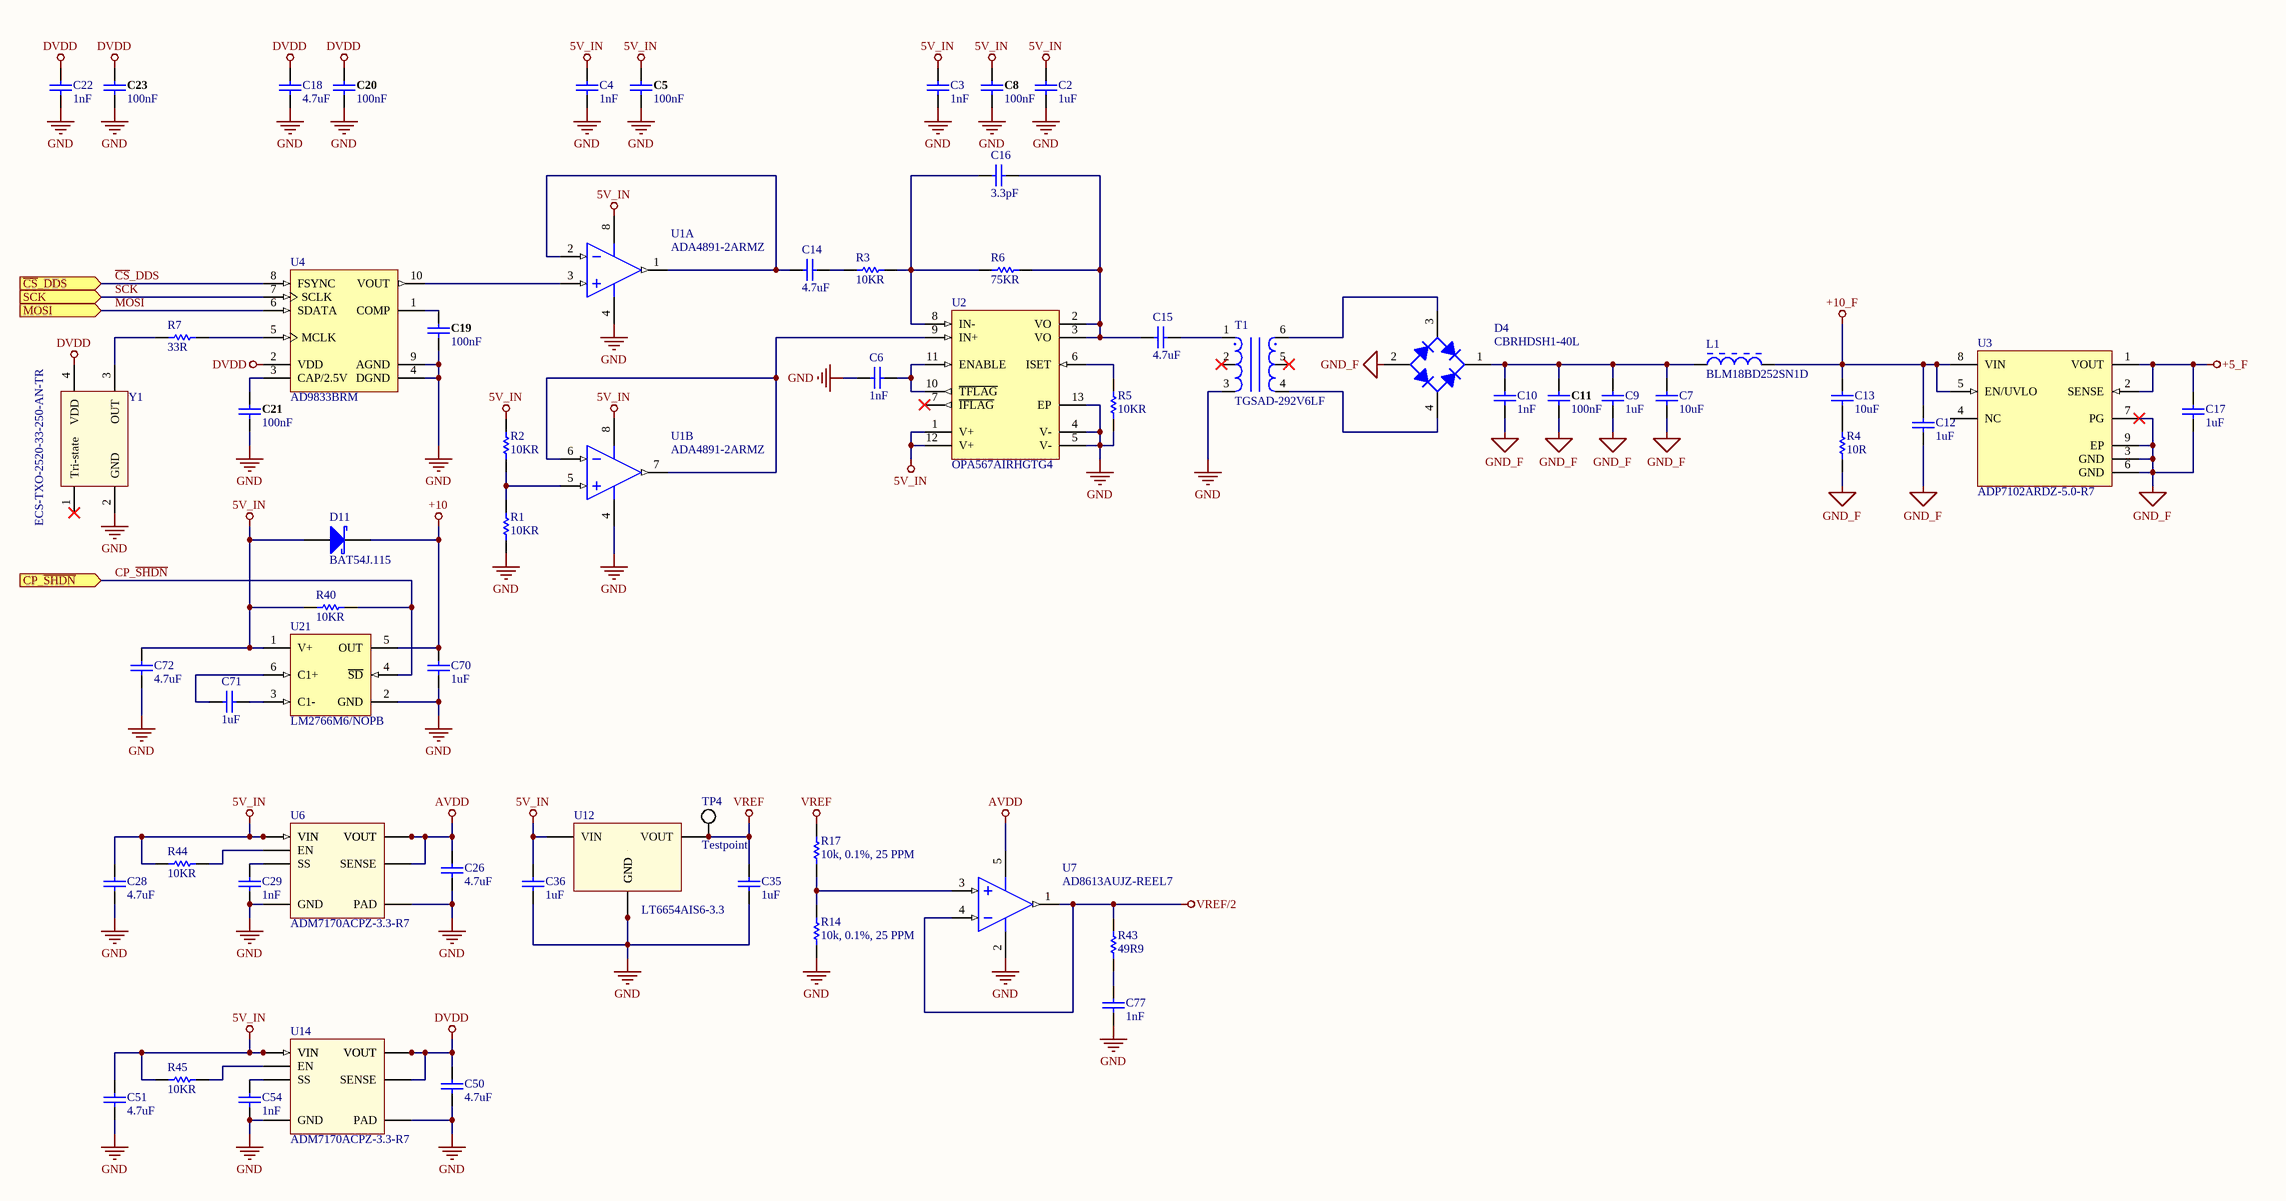
[diagram p2: Power.SchDoc]

### Parts
C2  1uF  [CAPC1608X90X40LL15T20]
C3  1nF  [CAPC1005X55X25ML5T10]
C4  1nF  [CAPC1005X55X25ML5T10]
C5  100nF  [CAPC1005]
C6  1nF  [CAPC1005X55X25ML5T10]
C7  10uF  [CAPC2013X95X45ML10T25]
C8  100nF  [CAPC1005]
C9  1uF  [CAPC1608X90X40LL15T20]
C10  1nF  [CAPC1005X55X25ML5T10]
C11  100nF  [CAPC1005]
C12  1uF  [CAPC1608X90X40LL15T20]
C13  10uF  [CAPC2013X95X45ML10T25]
C14  4.7uF  [CAPC1608X90X40LL15T20]
C15  4.7uF  [CAPC1608X90X40LL15T20]
C16  3.3pF  [CAPC1005X55X25ML05T05]
C17  1uF  [CAPC1608X90X40LL15T20]
C18  4.7uF  [CAPC1608X90X40LL15T20]
C19  100nF  [CAPC1005]
C20  100nF  [CAPC1005]
C21  100nF  [CAPC1005]
C22  1nF  [CAPC1005X55X25ML5T10]
C23  100nF  [CAPC1005]
C26  4.7uF  [CAPC1608X90X40LL15T20]
C28  4.7uF  [CAPC1608X90X40LL15T20]
C29  1nF  [CAPC1005X55X25ML5T10]
C35  1uF  [CAPC1608X90X40LL15T20]
C36  1uF  [CAPC1608X90X40LL15T20]
C50  4.7uF  [CAPC1608X90X40LL15T20]
C51  4.7uF  [CAPC1608X90X40LL15T20]
C54  1nF  [CAPC1005X55X25ML5T10]
C70  1uF  [CAPC1608X90X40LL15T20]
C71  1uF  [CAPC1608X90X40LL15T20]
C72  4.7uF  [CAPC1608X90X40LL15T20]
C77  1nF  [CAPC1005X55X25ML5T10]
D4  CBRHDSH1-40L  [HDDIP]
D11  BAT54J.115  [SOD-323]
L1  BLM18BD252SN1D  [MURA-BLM18-F-H1-CHIP-2_V]
R1  10KR  [RESC1005X40X25LL05T10]
R2  10KR  [RESC1005X40X25LL05T10]
R3  10KR  [RESC1005X40X25LL05T10]
R4  10R  [RESC1608X55X25LL10T15]
R5  10KR  [RESC1005X40X25LL05T10]
R6  75KR  [RESC1005X40X25LL05T10]
R7  33R  [RESC1005X40X25LL05T10]
R14  10k, 0.1%, 25 PPM  [RT0603]
R17  10k, 0.1%, 25 PPM  [RT0603]
R40  10KR  [RESC1005X40X25LL05T10]
R43  49R9  [RESC1005X40X25LL05T10]
R44  10KR  [RESC1005X40X25LL05T10]
R45  10KR  [RESC1005X40X25LL05T10]
T1  TGSAD-292V6LF  [TGSAD-V6LF]
TP4  Testpoint  [TESTPOINT]
U1  ADA4891-2ARMZ  [ADI-RM-8_L]  (parts A,B of 2)
U2  OPA567AIRHGTG4  [TI-RHG12-3120X3120TP_V]
U3  ADP7102ARDZ-5.0-R7  [ADI-RD-8-2_N]
U4  AD9833BRM  [ADI-RM-10_N]
U6  ADM7170ACPZ-3.3-R7  [LFCSP8]
U7  AD8613AUJZ-REEL7  [TSOT-23-5]
U12  LT6654AIS6-3.3  [SOT-23-6]
U14  ADM7170ACPZ-3.3-R7  [LFCSP8]
U21  LM2766M6/NOPB  [DBV0006A_N]
Y1  ECS-TXO-2520-33-250-AN-TR  [XTAL_ECS-TXO-2520-33-250]

### Ports
CP_~{SHDN} (in), MOSI (in), SCK (in), ~{CS}_DDS (in)

### Nets
5V_IN: C2.1 C3.2 C4.2 C5.1 C8.1 C28.2 C36.1 C51.2 C72.2 D11.2(A) R2.1 R40.2 R44.2 R45.2 U1.8(+VS) U2.1(V+) U2.12(V+) U6.7(VIN) U6.8(VIN) U12.4(VIN) U14.7(VIN) U14.8(VIN) U21.1(V+)
+5_F: C17.1 U3.1(VOUT) U3.2(SENSE)
+10: C70.2 D11.1(K) U21.5(OUT)
+10_F: C12.1 C13.2 L1.2 U3.5(EN/UVLO) U3.8(VIN)
AVDD: C26.2 U6.1(VOUT) U6.2(VOUT) U6.3(SENSE) U7.5
DVDD: C18.2 C20.1 C22.2 C23.1 C50.2 U4.2(VDD) U14.1(VOUT) U14.2(VOUT) U14.3(SENSE) Y1.4(VDD)
GND: C2.2 C3.1 C4.1 C5.2 C6.2 C8.2 C18.1 C19.2 C20.2 C21.2 C22.1 C23.2 C26.1 C28.1 C29.1 C35.2 C36.2 C50.1 C51.1 C54.1 C70.1 C72.1 C77.2 R1.2 R5.1 R14.1 T1.3 U1.4(-VS) U2.4(V-) U2.5(V-) U2.13(EP) U4.4(DGND) U4.9(AGND) U6.6(GND) U6.9(PAD) U7.2 U12.1(GND) U12.2(GND) U14.6(GND) U14.9(PAD) U21.2(GND) Y1.2(GND)
GND_F: C7.1 C9.2 C10.1 C11.2 C12.2 C17.2 D4.2(A) R4.1 U3.3(GND) U3.6(GND) U3.7(PG) U3.9(EP)
VREF: C35.1 R17.2 TP4.1 U12.6(VOUT)
VREF/2: R43.1 U7.1 U7.4
~{CS}_DDS: U4.8(FSYNC) ; port ~{CS}_DDS
CP_~{SHDN}: R40.1 U21.4(~{SD}) ; port CP_~{SHDN}
MOSI: U4.6(SDATA) ; port MOSI
SCK: U4.7(SCLK) ; port SCK
NetC6_1: C6.1 U2.10(~{TFLAG}) U2.11(ENABLE)
NetC7_2: C7.2 C9.1 C10.2 C11.1 D4.1(K) L1.1
NetC13_1: C13.1 R4.2
NetC14_1: C14.1 R3.1
NetC14_2: C14.2 U1.1(OUT_1) U1.2(-IN_1)
NetC15_1: C15.1 T1.1
NetC15_2: C15.2 C16.2 R6.2 U2.2(VO) U2.3(VO)
NetC16_1: C16.1 R3.2 R6.1 U2.8(IN-)
NetC19_1: C19.1 U4.1(COMP)
NetC21_1: C21.1 U4.3(CAP/2.5V)
NetC29_2: C29.2 U6.4(SS)
NetC54_2: C54.2 U14.4(SS)
NetC71_1: C71.1 U21.3(C1-)
NetC71_2: C71.2 U21.6(C1+)
NetC77_1: C77.1 R43.2
NetD4_3: D4.3(C) T1.6
NetD4_4: D4.4(C) T1.4
NetR1_1: R1.1 R2.2 U1.5(+IN_2)
NetR5_2: R5.2 U2.6(ISET)
NetR7_1: R7.1 Y1.3(OUT)
NetR7_2: R7.2 U4.5(MCLK)
NetR14_2: R14.2 R17.1 U7.3
NetR44_1: R44.1 U6.5(EN)
NetR45_1: R45.1 U14.5(EN)
NetU1_3: U1.3(+IN_1) U4.10(VOUT)
NetU1_6: U1.6(-IN_2) U1.7(OUT_2) U2.9(IN+)
NetU12_3: U12.3(DNC) U12.5(DNC)

Not connected (* = marked no-connect by the designer): T1 2* 5*; U2 7(~{IFLAG})*; U3 4(NC); Y1 1(Tri-state)*

### Notes on the sheet
- Title
- Size:
- Date:
- File:
- A2
- Number:
- Time:
- Revision:
- Sheet
- of

### Library data of the parts
C2 C9 C12 C17 C35 C36 C70 C71 = CMP-2000-06074-1: as C58 on sheet Main; Thickness (Max): 0.035"(0.90mm); Mounting Type: SurfaceMount,MLCC; Datasheet Version: Rev. 21, 01/2016; Datasheet URL: http://www.yageo.com/documents/recent/UPY-GPHC_X5R_4V-to-50V-21.pdf; Size / Dimension: 0.063"Lx0.031"W(1.60mmx0.80mm); Standard Package: 1; Operating Temperature: -55°C~85°C; Category: Capacitors; Manufacturer URL: http://www.yageo.com/; Package Reference: 0603; Family: CeramicCapacitors; Series: CC; Packaging: Digi-Reel®; Mounting Technology: SurfaceMount; Package Description: 2-Pin Surface Mount Device, Body 1.6 x 0.8 mm; Applications: GeneralPurpose; Package / Case: 0603(1608Metric)
C3 C4 C6 C10 C22 C29 C54 C77 = CMP-2100-03592-1: as C39 on sheet Main; Package Description: 2-Pin Surface Mount Device, Body 1 x 0.5 mm; REACH SVHC: NoSVHC; Depth: 0.5mm; Length: 1mm; Radiation Hardening: No; Thickness: 0.022inch; Lead Free: LeadFree; Height: 0.5mm; Packaging: TapeandReel; RoHSCompliant: True; Termination: SMD/SMT; Min Operating Temperature: -55degC; Composition: Ceramic; Case Code (Metric): 1005; Voltage Rating: 50V; Case Code (Imperial): 0402; Mount: SurfaceMount; Package Reference: 0402; Voltage: 50V; Manufacturer URL: http://www.yageo.com/; Width: 0.5mm; Package Quantity: 1; Datasheet Version: Rev. 15, 10/2016; Max Operating Temperature: 125degC; Datasheet URL: http://www.yageo.com/documents/recent/UPY-GPHC_X7R_6.3V-to-50V_15.pdf; Case/Package: 0402
C5 C8 C11 C19-C21 C23 = CMP-0001-00074-1: as C25 on sheet Main; ClassName: Board Template Device; Status: Production; Mounting Technology: Surface Mount; Technology: Ceramic; Category: Capacitor; Publisher: Altium
C7 C13 = CMP-2007-00182-1: GRM219R61E106KA12D; Manufacturer: Murata; Part Number: GRM219R61E106KA12D
C14 C15 C18 C26 C28 C50 C51 C72 = CMP-2000-06074-1: as C57 on sheet Main; Thickness (Max): 0.035"(0.90mm); Mounting Type: SurfaceMount,MLCC; Datasheet Version: Rev. 21, 01/2016; Datasheet URL: http://www.yageo.com/documents/recent/UPY-GPHC_X5R_4V-to-50V-21.pdf; Size / Dimension: 0.063"Lx0.031"W(1.60mmx0.80mm); Standard Package: 1; Operating Temperature: -55°C~85°C; Category: Capacitors; Manufacturer URL: http://www.yageo.com/; Package Reference: 0603; Family: CeramicCapacitors; Series: CC; Packaging: Digi-Reel®; Mounting Technology: SurfaceMount; Package Description: 2-Pin Surface Mount Device, Body 1.6 x 0.8 mm; Applications: GeneralPurpose; Package / Case: 0603(1608Metric)
C16 = CMP-2100-03589-1: CC0402CRNPO9BN3R3; Manufacturer: Yageo; Insulation Resistance: 100GR; Voltage Rating (DC): 50V; Dielectric Material: Ceramic; Tolerance: 5%; Temperature Coefficient: 30ppm/degC; Dielectric: C0G; Capacitance: 10pF; Termination: SMD/SMT; Package Reference: 0402; Lead Free: LeadFree; Composition: Ceramic; Case Code (Metric): 1005; Voltage Rating: 50V; Packaging: TapeandReel; Manufacturer URL: http://www.yageo.com/; REACH SVHC: NoSVHC; Max Operating Temperature: 125degC; Length: 1mm; Mount: SurfaceMount; Depth: 0.5mm; Min Operating Temperature: -55degC; Number of Pins: 2; Width: 0.02inch; Datasheet Version: Rev. 14, 07/2016; Package Quantity: 1; Datasheet URL: http://www.yageo.com/documents/recent/UPY-GP_NP0_16V-to-50V_14.pdf; Case Code (Imperial): 0402; RoHSCompliant: True; Radiation Hardening: No; Height: 0.5mm; Case/Package: 0402; Thickness: 0.022inch; Package Description: 2-Pin Surface Mount Device, Body 1 x 0.5 mm; Voltage: 50V
D4 = CBRHDSH1-40L: The CENTRAL SEMICONDUCTOR CBRHDSH1-40L / is a full wave bridge rectifier mounted in a durable / epoxy surface mount molded case, utilizing glass / passivated chips.
L1 = CMP-0686-00418-1: as L3 on sheet Main; ComponentLink2Description: Datasheet; ComponentLink3Description: Package Specification; ComponentLink3URL: http://www.murata.com/products/catalog/pdf/c31e.pdf; Operating Temperature Range: -55 to 125 degC; ComponentLink1URL: http://www.murata.com/; Mounting Technology: Surface Mount; PartNumber: BLM18BD252SN1D; PackageReference: BLM18_H950-2; ComponentLink2URL: http://www.murata.com/products/catalog/pdf/c31e.pdf; DatasheetVersion: 08/2013; PackageDescription: 2-Pin Chip, Body 1.6 x 0.8 mm, Pitch 1.65 mm; ComponentLink1Description: Manufacturer URL; Packing: Tape and Reel
R1-R3 R5 R40 R44 R45 = CMP-2002-07353-1: as R8 on sheet Main; Part Number: RC0402FR-0710KL
R4 = CMP-1659-00008-2: RC0603FR-0710RL; Manufacturer: Yageo; ComponentLink1Description: Datasheet; PackageReference: 0603; PartNumber: RC0603FR-0710RL; ComponentLink1URL: http://www.yageo.com/documents/recent/PYu-RC_Group_51_RoHS_L_04.pdf
R6 = CMP-2002-07797-1: RC0402FR-0775KL; Manufacturer: Yageo / Phycomp; Part Number: RC0402FR-0775KL
R7 = CMP-2002-07619-1: RC0402FR-0733RL; Manufacturer: Yageo / Phycomp; Part Number: RC0402FR-0733RL
R14 R17 = RT0603BRD0710KL
R43 = CMP-2002-07709-1: as R28 on sheet Main; Part Number: RC0402FR-0749R9L
T1 = TGSAD-292V6LF: 1:5
U1 = CMP-0384-01745-1: Double Channel Single-Supply Operation Operational Amplifier, 220 MHz BW, 170 V/us SR, Industrial, 8-pin SOP (RM-8), Tube; Manufacturer: Analog Devices; Input Offset Voltage: 2.5mV; Small Signal Bandwidth: 220MHz; Iq/Amp: 4.4mA; Input Bias Current: 2pA; Amplifiers Per Package: 2; V Span Max: 5.5V; V Span Min: 2.7V; ComponentLink1URL: http://www.analog.com/en/index.html; ComponentLink2URL: http://www.analog.com/static/imported-files/data_sheets/ADA4891-1_4891-2_4891-3_4891-4.PDF; ComponentLink3URL: http://www.analog.com/static/imported-files/packages/PKG_PDF/MSOP%28RM%29/RM_8.pdf; Slew Rate: 170V/us; ComponentLink2Description: Datasheet; Mounting Technology: Surface Mount; PartNumber: ADA4891-2ARMZ; ComponentLink1Description: Manufacturer URL; ComponentLink3Description: Package Specification; Packing: Tube; Generic Part Number: ADA4891-2; DatasheetVersion: Rev. D; PackageReference: RM-8; PackageDescription: 8-Pin Mini Small Outline Package, Body 3 x 3 mm, Pitch 0.65 mm; Code_JEDEC: MO-187-AA; PartId: 1
U2 = CMP-0272-04145-1: Rail-to-Rail I/O, 2 A Power Amplifier, 2.7 to 5.5 V, -55 to 125 degC, 12-pin QFN (RHG12), Green (RoHS & no Sb/Br); CMRR(Min)(dB): 80; Packing: SMALL T&R; Sub Family: High Output Current Amplifier (>=50mA), Low Input Bias Current Amp (<=10pA), Low Supply Voltage Amplifier (<=2.7V), Precision Amplifier; Number of Channels: 1; Total Supply Voltage(Max)(+5V is 5, +/-5V is 10): 5.5; IIB(Max)(pA): 10; Slew Rate(Typ)(V/us): 1.2; Iq per channel(Max)(mA): 6; Vio (25C)(Max)(mV): 2; Total Supply Voltage(Min)(+5V is 5, +/-5V is 10): 2.7; Offset Drift(Typ)(uV/C): 1.3; Rating: Catalog; PartNumber: OPA567AIRHGTG4; ComponentLink3URL: http://www.ti.com/litv/pdf/mpqf142c; PackageDescription: 12-Pin Plastic Quad Flatpack No-Lead, Body 5 x 5 mm, Pitch 1 mm; Mounting Technology: Surface Mount; ComponentLink3Description: Package Specification; ComponentLink1URL: http://www.ti.com/; ComponentLink1Description: Manufacturer URL; PackageReference: RHG12-3120X3120TP; Code_JEDEC: MO-220; ComponentLink2Description: Datasheet; ComponentLink2URL: http://www.ti.com/lit/ds/symlink/opa567.pdf; Eco-Plan: Green (RoHS & no Sb/Br); PackageVersion: 4205052/E, 12/2010; GBW(Typ)(MHz): 1.2; DatasheetVersion: SBOS287A
U3 = CMP-0786-00210-1: 300 mA, Low Noise, CMOS LDO, 3.3 to 20 V Vin, 5 V Vout, Industrial, 8-pin SOIC (RD-8-2), Reel; Manufacturer: Analog Devices; Preset Vout Values (V): 5.0; Vin (max) (V): 20; Iout max: 300mA; Supply Current IGND @ Small Load: 400uA; Vin (min) (V): 3.3; ComponentLink4URL: Product URL:http://www.analog.com/en/ADP7102/productSearch.html; ComponentLink3URL: http://www.analog.com/static/imported-files/packages/62062404671038RD_8_2.pdf; Mounting Technology: Surface Mount; PackageVersion: Jan-05; Packing: Reel; ComponentLink1Description: Manufacturer URL; PartNumber: ADP7102ARDZ-5.0-R7; ComponentLink1URL: http://www.analog.com/en/index.html; ComponentLink2Description: Datasheet; ComponentLink3Description: Package Specification; DatasheetVersion: Rev. A; PackageDescription: 8-Pin Standard Small Outline Package, Body 4.9 x 3.9 mm, Pitch 1.27 mm; PackageReference: RD-8-2; Code_JEDEC: MS-012-AA; ComponentLink2URL: http://www.analog.com/static/imported-files/data_sheets/ADP7102.pdf; ComponentLink4Description: URL Link1
U4 = CMP-0293-00075-1: Low Power, 12.65 mW, 2.3 V to 5.5 V, Programmable Waveform Generator, 10-Bit, Serial, RM-10, 50 Tube; Tuning Word Width (bits): 28bit; Resolution (Bits): 10bit; Master fclk: 25MHz; REFCLK Multiplier: No; Compliance Range (V): 650mV; I Supply total (max): 5.5mA; FS Iout (mA nom): 3mA; DatasheetVersion: Rev. D; I/O Interface: Serial; PackageReference: RM-10; PackageDescription: 10-Lead Mini Small Outline Package [MSOP]; PackageVersion: 5/8/2005; ComponentLink3URL: http://www.analog.com/static/imported-files/packages/PKG_PDF/MSOP%28RM%29/RM_10.pdf; ComponentLink1Description: Manufacturer URL; ComponentLink2Description: Datasheet; Code_JEDEC: MO-187-BA; ComponentLink2URL: http://www.analog.com/static/imported-files/data_sheets/AD9833.pdf; ComponentLink1URL: www.analog.com; ComponentLink3Description: Package Specification
U7 = AD8613AUJZ-REEL7: Low Cost Micropower, Low Noise CMOS / Rail-to-Rail, Input/Output Operational Amplifiers
U12 = LT6654AIS6-3.3: Precision Wide Supply High Output Drive Low Noise Reference
U21 = CMP-0065-00090-3: Switched Capacitor Voltage Converter, 6-pin SOT-23, Pb-Free; Manufacturer: Texas Instruments; PackageTopMarking: S16B*XTT; PowerWise: N; CompType: Switch Caps; Code_JEDEC: MO-178-AB; Code_IPC: SOT26A-6; PackageReference: DBV0006A; PinCount: 6; PackageDescription: Molded SOT-23, .115 x .063 x .040in Body, 6 Lead, .0375in in Pitch; ComponentLink1Description: Datasheet URL; ComponentLink1URL: http://www.ti.com/general/docs/lit/getliterature.tsp?genericPartNumber=LM2766&fileType=pdf; RoHS: Y

## Nets that join several sheets
5V_IN: Main (10 pins), Power (23 pins)
+5_F: Main (C25.1 U5.8), Power (C17.1 U3.1 U3.2)
+10: Main (Q8.3 R30.1), Power (C70.2 D11.1 U21.5)
+10_F: Main (R8.2), Power (5 pins)
AVDD: Main (15 pins), Power (5 pins)
DVDD: Main (38 pins), Power (10 pins)
GND: Main (99 pins), Power (42 pins)
GND_F: Main (6 pins), Power (12 pins)
VREF: Main (C38.1 U8.10), Power (C35.1 R17.2 TP4.1 U12.6)
VREF/2: Main (U11.3 U22.3), Power (R43.1 U7.1 U7.4)
~{CS}_DDS: Main (R23.1), Power (U4.8)
CP_~{SHDN}: Main (R31.3), Power (R40.1 U21.4)
MOSI: Main (R31.5 U8.8), Power (U4.6)
SCK: Main (R19.3 U8.7), Power (U4.7)